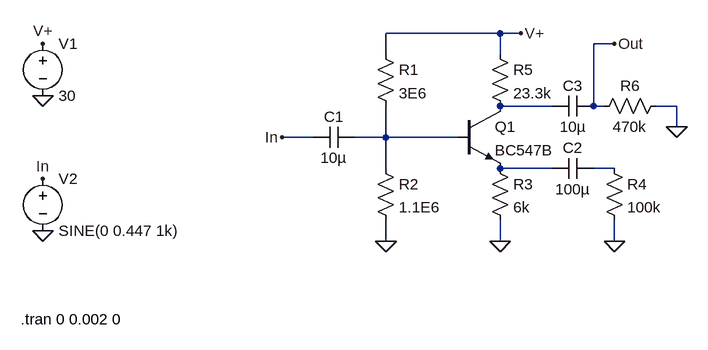
[diagram p0: schematic ClassAPreAmp.asc]
ClassAPreAmp.asc, the LTspice schematic file:
Version 4
SHEET 1 932 680
WIRE 640 -96 464 -96
WIRE 672 -96 640 -96
WIRE 816 -80 784 -80
WIRE 464 -64 464 -96
WIRE 640 -64 640 -96
WIRE 720 16 640 16
WIRE 784 16 784 -80
WIRE 800 16 784 16
WIRE 912 16 880 16
WIRE 912 48 912 16
WIRE 352 64 304 64
WIRE 464 64 464 16
WIRE 464 64 416 64
WIRE 576 64 464 64
WIRE 464 112 464 64
WIRE 720 112 640 112
WIRE 816 112 784 112
WIRE 464 224 464 192
WIRE 640 224 640 192
WIRE 816 224 816 192
FLAG -64 -80 V+
FLAG -64 0 0
FLAG -64 128 In
FLAG -64 208 0
FLAG 304 64 In
FLAG 464 224 0
FLAG 640 224 0
FLAG 816 224 0
FLAG 672 -96 V+
FLAG 912 48 0
FLAG 816 -80 Out
SYMBOL voltage -64 -96 R0
WINDOW 123 0 0 Left 0
WINDOW 39 0 0 Left 0
SYMATTR InstName V1
SYMATTR Value 30
SYMBOL voltage -64 112 R0
WINDOW 123 0 0 Left 0
WINDOW 39 0 0 Left 0
SYMATTR InstName V2
SYMATTR Value SINE(0 0.447 1k)
SYMBOL cap 416 48 R90
WINDOW 0 0 32 VBottom 2
WINDOW 3 32 32 VTop 2
SYMATTR InstName C1
SYMATTR Value 10µ
SYMBOL res 448 -80 R0
SYMATTR InstName R1
SYMATTR Value 3E6
SYMBOL res 448 96 R0
SYMATTR InstName R2
SYMATTR Value 1.1E6
SYMBOL npn 576 16 R0
SYMATTR InstName Q1
SYMATTR Value BC547B
SYMBOL res 624 96 R0
SYMATTR InstName R3
SYMATTR Value 6k
SYMBOL cap 784 96 R90
WINDOW 0 0 32 VBottom 2
WINDOW 3 32 32 VTop 2
SYMATTR InstName C2
SYMATTR Value 100µ
SYMBOL res 800 96 R0
SYMATTR InstName R4
SYMATTR Value 100k
SYMBOL res 624 -80 R0
SYMATTR InstName R5
SYMATTR Value 23.3k
SYMBOL cap 784 0 R90
WINDOW 0 0 32 VBottom 2
WINDOW 3 32 32 VTop 2
SYMATTR InstName C3
SYMATTR Value 10µ
SYMBOL res 896 0 R90
WINDOW 0 0 56 VBottom 2
WINDOW 3 32 56 VTop 2
SYMATTR InstName R6
SYMATTR Value 470k
TEXT -98 344 Left 2 !.tran 0 0.002 0

The netlist it stands for:
* ClassAPreAmp.asc
V1 V+ 0 30
V2 In 0 SINE(0 0.447 1k)
C1 N002 In 10µ
R1 V+ N002 3E6
R2 N002 0 1.1E6
Q1 N001 N002 N003 0 BC547B
R3 N003 0 6k
C2 N004 N003 100µ
R4 N004 0 100k
R5 V+ N001 23.3k
C3 Out N001 10µ
R6 0 Out 470k
.model NPN NPN
.model PNP PNP
.lib standard.bjt
.tran 0 0.002 0
.backanno
.end